# EAGLE schematic Touch (EAGLE 9.4.2)
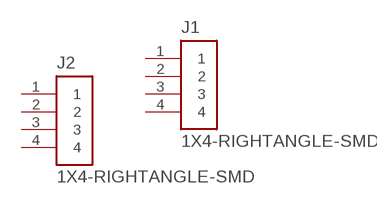
[diagram p0: schematic, sheet 1]

## Parts
J1  1X4-RIGHTANGLE-SMD  [1X4-RIGHTANGLE-SMD]
J2  1X4-RIGHTANGLE-SMD  [1X4-RIGHTANGLE-SMD]
Unconnected: J1.1 J1.2 J1.3 J1.4 J2.1 J2.2 J2.3 J2.4

## Library data of the parts
J1 J2 = Actuator Circle:1X4-RIGHTANGLE-SMD